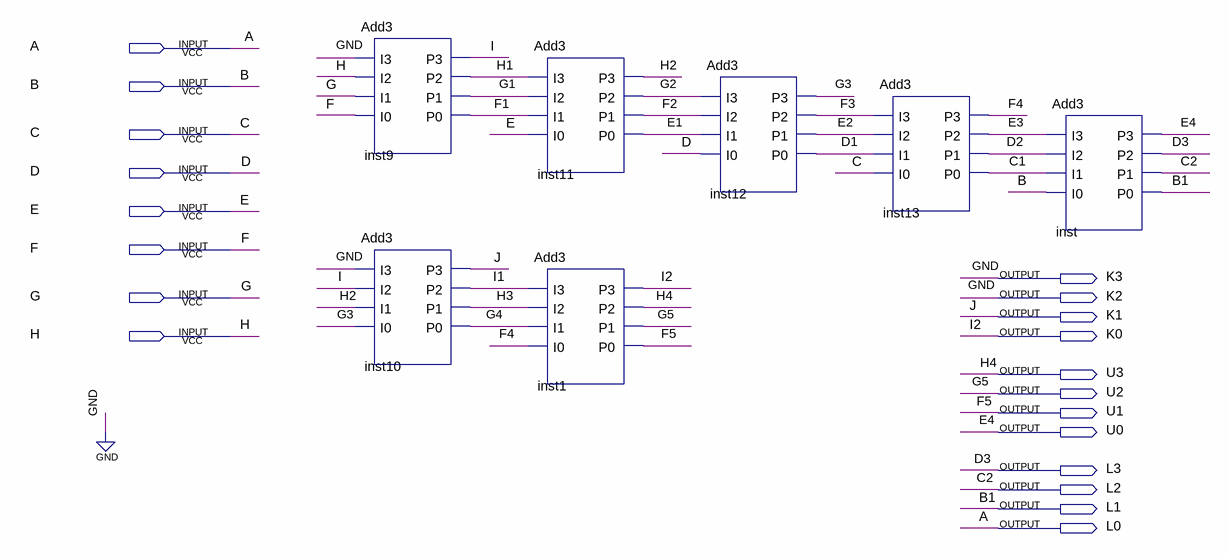
[diagram p0: schematic sheet]
// Quartus schematic BDC3.bdf as structural Verilog: 7 symbols, 20 pins
module BDC3 (
  input  A,
  input  B,
  input  C,
  input  D,
  input  E,
  input  F,
  input  G,
  input  H,
  output K3,
  output K2,
  output K1,
  output K0,
  output U3,
  output U2,
  output U1,
  output U0,
  output L3,
  output L2,
  output L1,
  output L0
);

  wire C1, D1, D2, E1, E2, E3, F1, F2, F3, F4, G1, G2, G3, G4, H1, H2, H3, I, I1;

  Add3 inst9 (.I3(1'b0), .I2(H), .I1(G), .I0(F), .P3(I), .P2(H1), .P1(G1), .P0(F1));
  Add3 inst10 (.I3(1'b0), .I2(I), .I1(H2), .I0(G3), .P3(K1), .P2(I1), .P1(H3), .P0(G4));
  Add3 inst11 (.I3(H1), .I2(G1), .I1(F1), .I0(E), .P3(H2), .P2(G2), .P1(F2), .P0(E1));
  Add3 inst1 (.I3(I1), .I2(H3), .I1(G4), .I0(F4), .P3(K0), .P2(U3), .P1(U2), .P0(U1));
  Add3 inst12 (.I3(G2), .I2(F2), .I1(E1), .I0(D), .P3(G3), .P2(F3), .P1(E2), .P0(D1));
  Add3 inst13 (.I3(F3), .I2(E2), .I1(D1), .I0(C), .P3(F4), .P2(E3), .P1(D2), .P0(C1));
  Add3 inst (.I3(E3), .I2(D2), .I1(C1), .I0(B), .P3(U0), .P2(L3), .P1(L2), .P0(L1));

  assign K2 = 1'b0;
  assign K3 = 1'b0;
  assign L0 = A;

  // Other names for the same wires on the sheet: B1 = L1; C2 = L2; D3 = L3; E4 = U0; F5 = U1; G5 = U2; H4 = U3;
  //   I2 = K0; J = K1
endmodule
